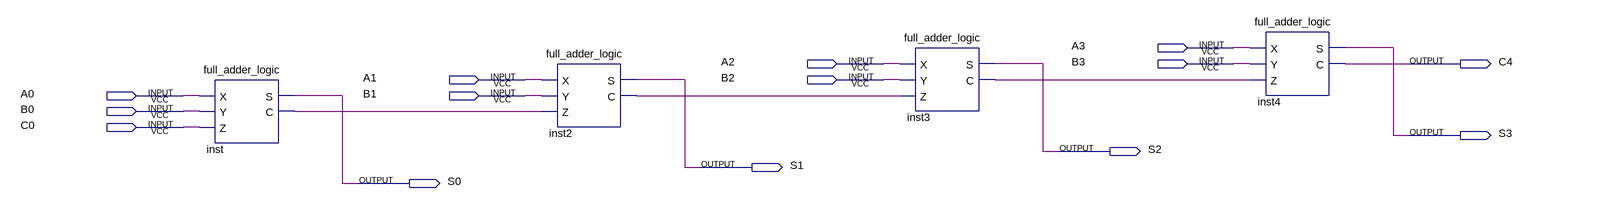
[diagram p0: schematic sheet]
// Quartus schematic ripple_carry_adder_logic.bdf as structural Verilog: 4 symbols, 14 pins
module ripple_carry_adder_logic (
  input  A3,
  input  A2,
  input  B3,
  input  A1,
  input  B2,
  input  A0,
  input  B1,
  input  B0,
  input  C0,
  output C4,
  output S3,
  output S2,
  output S1,
  output S0
);

  wire inst2_c, inst3_c, inst_c;

  full_adder_logic inst (.X(A0), .Y(B0), .Z(C0), .S(S0), .C(inst_c));
  full_adder_logic inst2 (.X(A1), .Y(B1), .Z(inst_c), .S(S1), .C(inst2_c));
  full_adder_logic inst3 (.X(A2), .Y(B2), .Z(inst2_c), .S(S2), .C(inst3_c));
  full_adder_logic inst4 (.X(A3), .Y(B3), .Z(inst3_c), .S(S3), .C(C4));
endmodule
